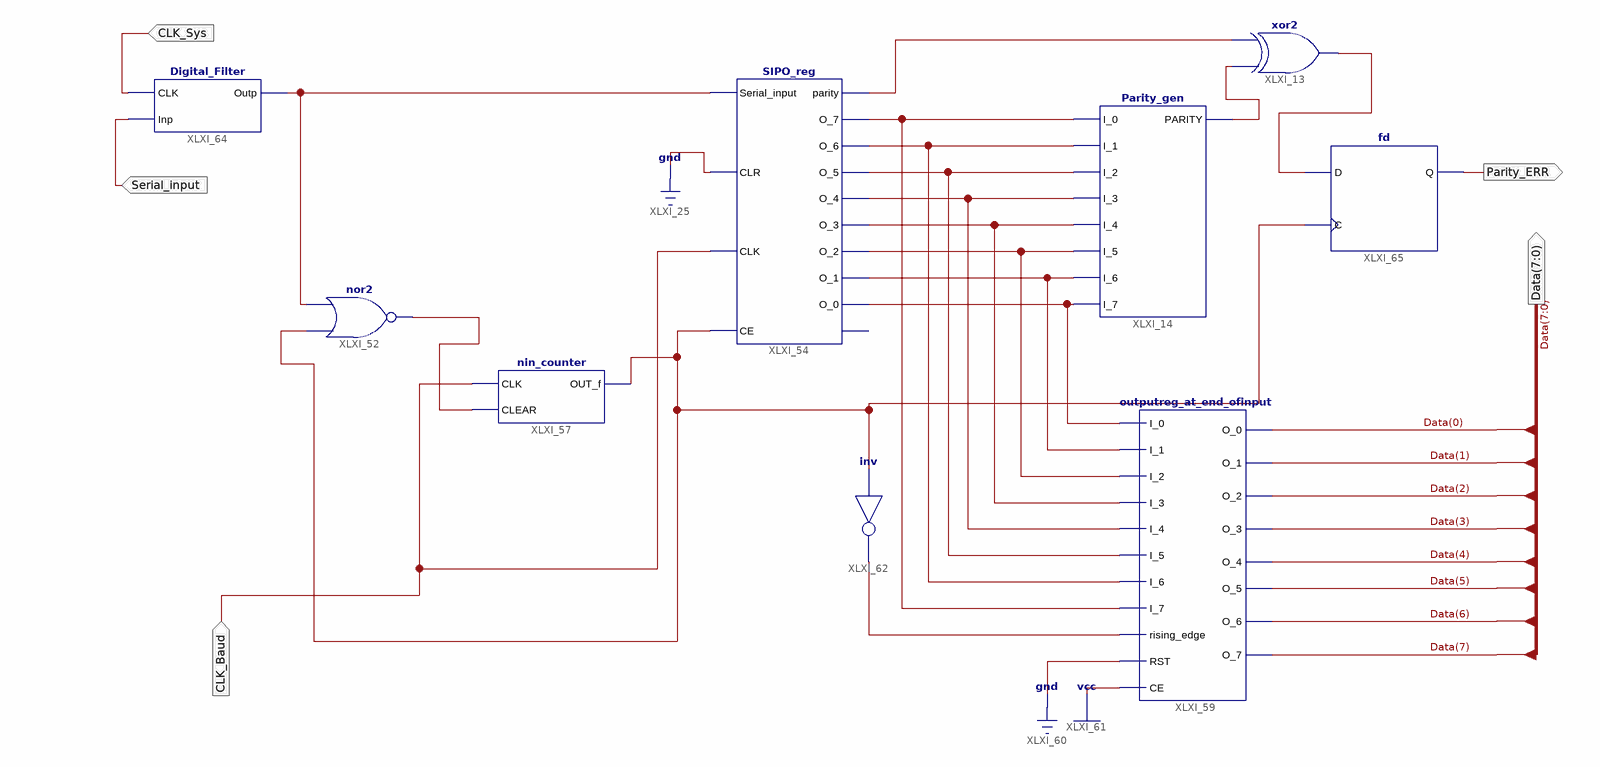
[diagram p0: schematic sheet 1]
// Xilinx ISE schematic usart_receiver.sch (spartan3e) as structural Verilog: 9 symbols, 5 ports
module usart_receiver (
  input  CLK_Baud,
  input  Serial_input,
  input  CLK_Sys,
  output Parity_ERR,
  output [7:0] Data
);

  wire dec, par, XLXN_52, XLXN_63, XLXN_123, XLXN_134, XLXN_135, XLXN_136, XLXN_137, XLXN_138, XLXN_159,
       XLXN_160, XLXN_161, XLXN_165, XLXN_170;

  xor XLXI_13 (XLXN_170, XLXN_63, par);
  Parity_gen XLXI_14 (
    .I_0(XLXN_138), .I_1(XLXN_137), .I_2(XLXN_136), .I_3(XLXN_135), .I_4(XLXN_134), .I_5(XLXN_161),
    .I_6(XLXN_160), .I_7(XLXN_159), .PARITY(XLXN_63));
  nor XLXI_52 (XLXN_123, dec, XLXN_165);
  SIPO_reg XLXI_54 (
    .CE(dec), .CLK(CLK_Baud), .CLR(1'b0), .Serial_input(XLXN_165), .O_0(XLXN_159), .O_1(XLXN_160),
    .O_2(XLXN_161), .O_3(XLXN_134), .O_4(XLXN_135), .O_5(XLXN_136), .O_6(XLXN_137), .O_7(XLXN_138),
    .parity(par));  // open: start_bit
  nin_counter XLXI_57 (.CLK(CLK_Baud), .CLEAR(XLXN_123), .OUT_f(dec));
  outputreg_at_end_ofinput XLXI_59 (
    .O_5(Data[5]), .O_6(Data[6]), .O_7(Data[7]), .O_1(Data[1]), .O_2(Data[2]), .O_3(Data[3]), .O_0(Data[0]),
    .O_4(Data[4]), .rising_edge(XLXN_52), .RST(1'b0), .CE(1'b1), .I_5(XLXN_136), .I_6(XLXN_137),
    .I_7(XLXN_138), .I_4(XLXN_135), .I_2(XLXN_161), .I_3(XLXN_134), .I_1(XLXN_160), .I_0(XLXN_159));
  not XLXI_62 (XLXN_52, dec);
  Digital_Filter XLXI_64 (.CLK(CLK_Sys), .Inp(Serial_input), .Outp(XLXN_165));
  fd XLXI_65 (.C(dec), .D(XLXN_170), .Q(Parity_ERR));
endmodule
